# EasyEDA Pro project ProProject_Quadrotor_Mk2.epro, schematic Schematic1
Create Date: 2024-08-03; Page Name: P1; Project Name: Quadrotor_Mk2; Schematic Name: Schematic1; Update Date: 2024-09-01; Company: EasyEDA.com; Drawn: EasyEDA; Page Size: A4; Part Number: JLCPCB-002; Reviewed: EasyEDA; Version: V0.1
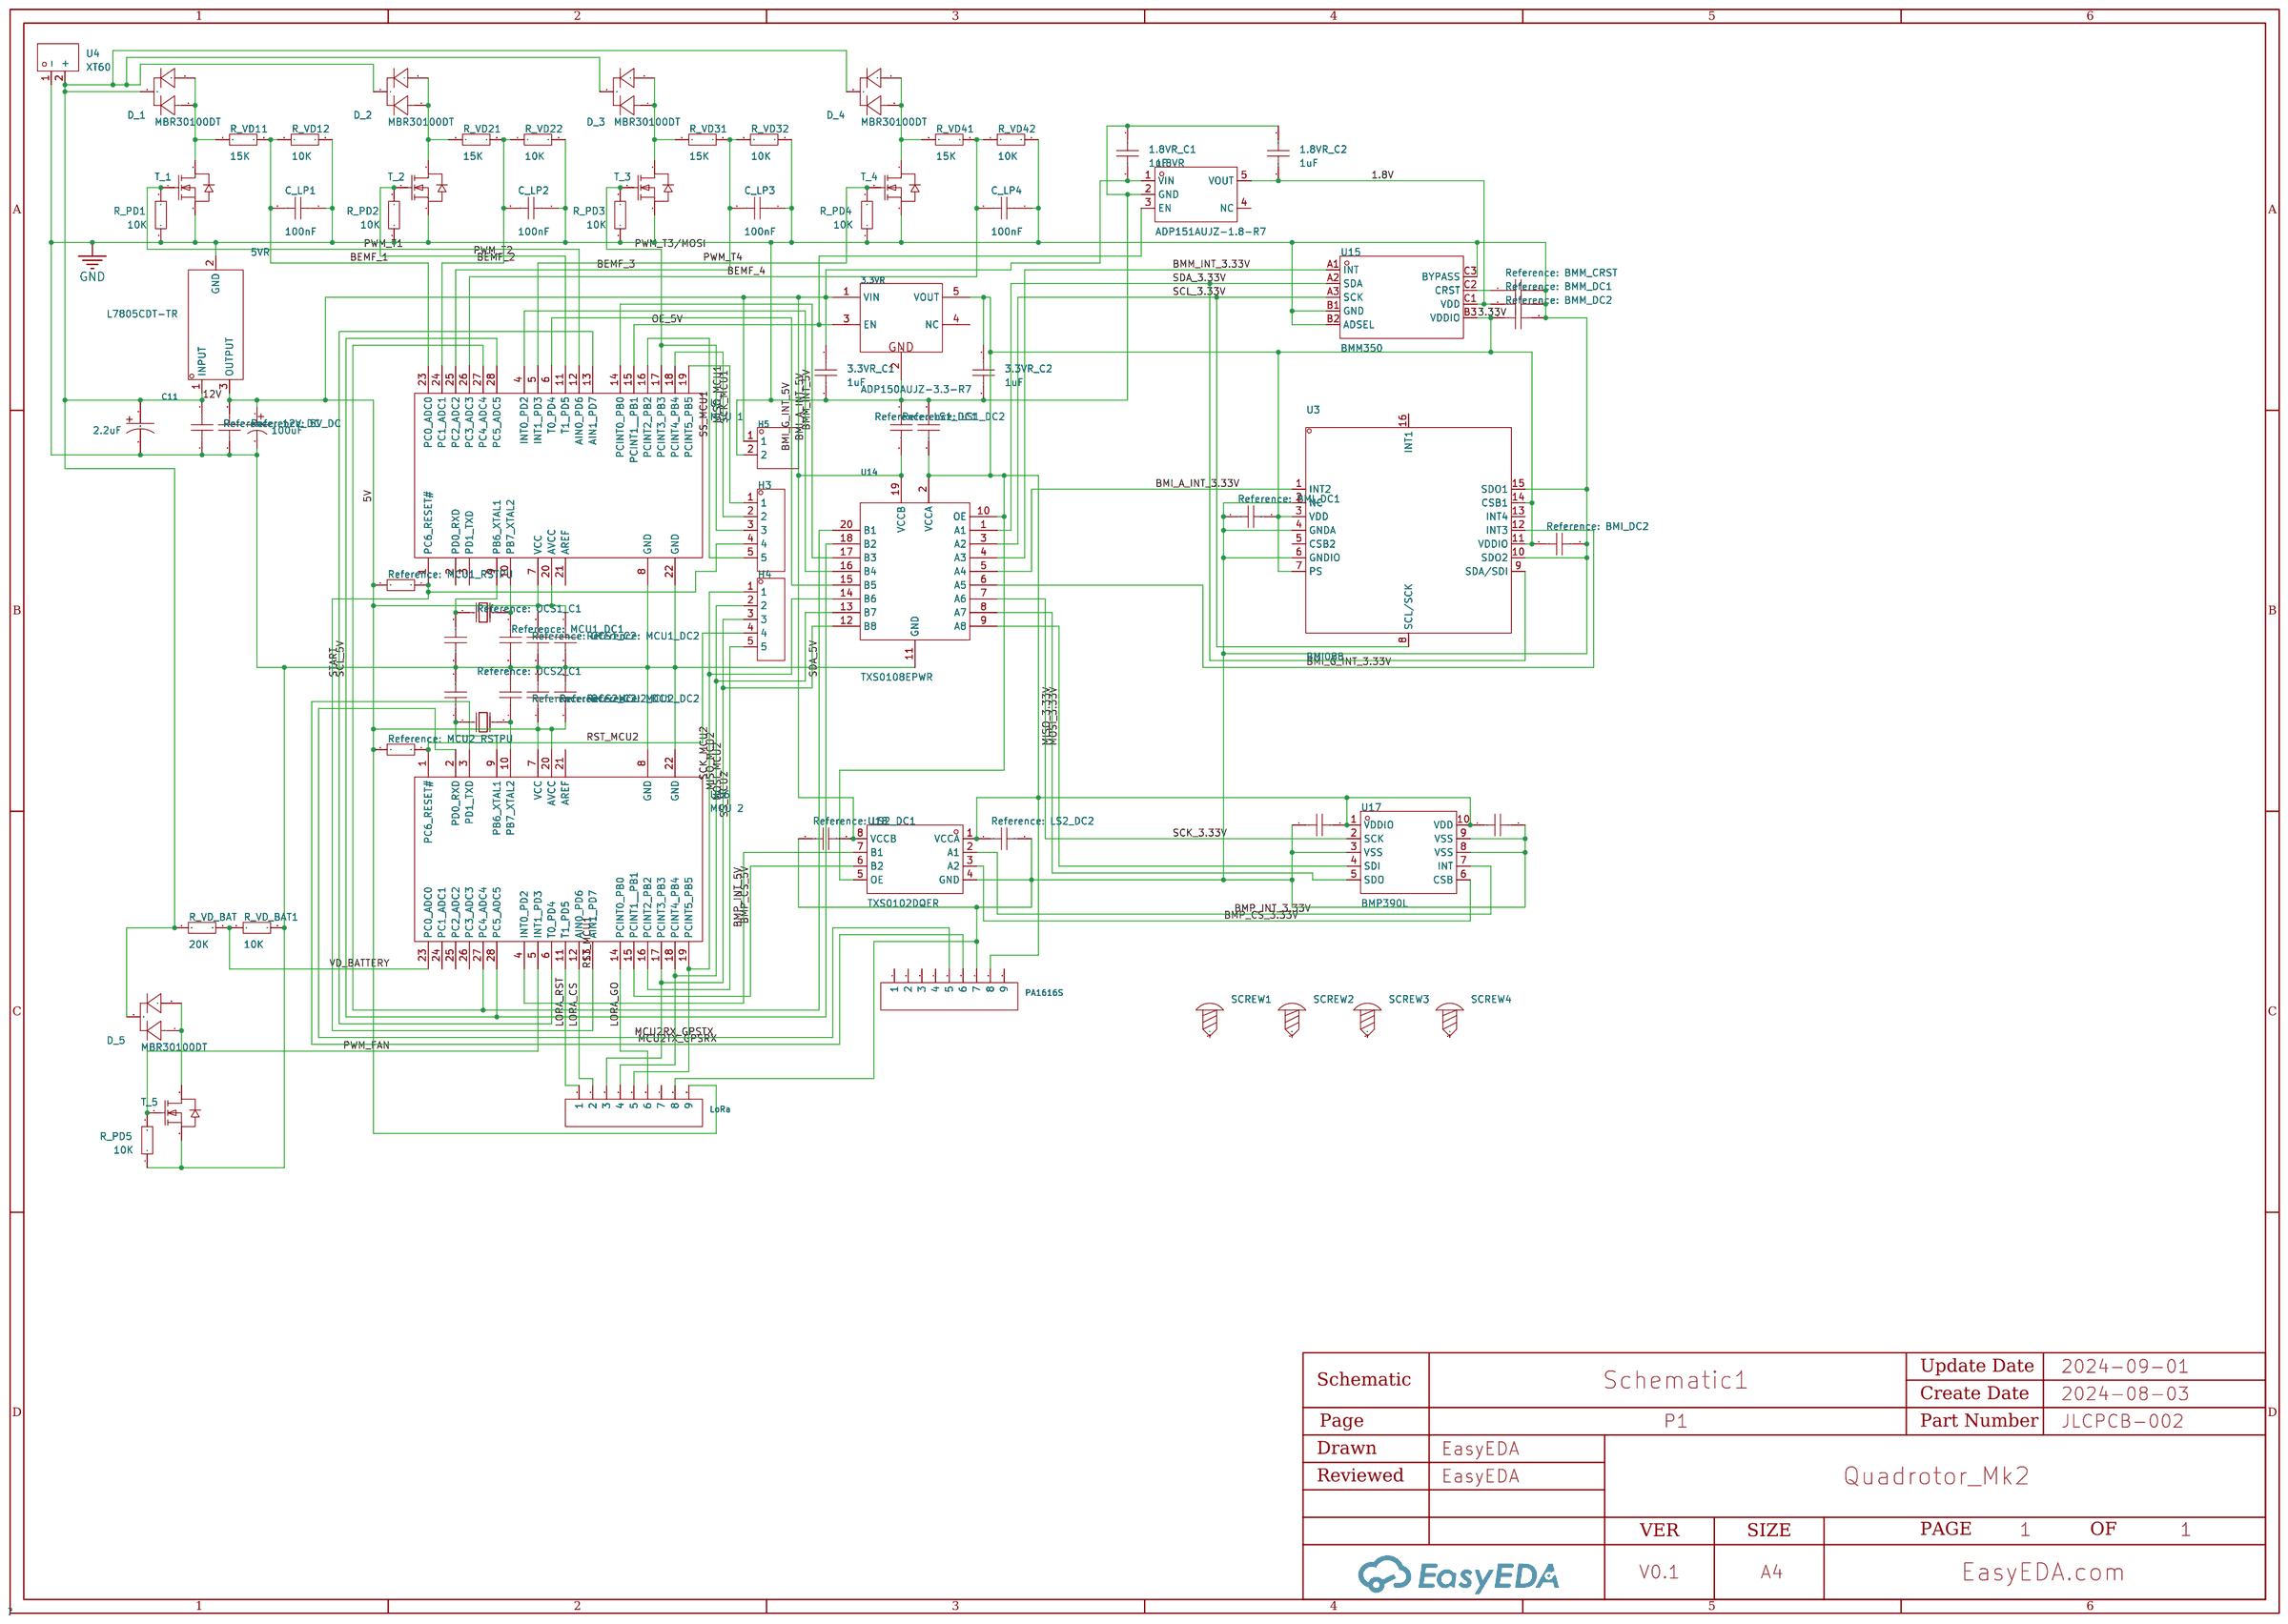
[diagram p0: schematic sheet]

## Parts
1.8VR  ADP151AUJZ-1.8-R7  [TSOT-23-5_L2.9-W1.6-P0.95-LS2.8-BR]
1.8VR_C1  1uF  [C0603]
1.8VR_C2  1uF  [C0603]
3.3VR  ADP150AUJZ-3.3-R7  [SOT-23-5_L3.0-W1.7-P0.95-LS2.8-BR]
3.3VR_C1  1uF  [C0603]
3.3VR_C2  1uF  [C0603]
5V_DC  100nF  [C0603]
5VR  L7805CDT-TR  [TO-252-3_L6.5-W5.8-P4.58-BL]
12V_DC  100nF  [C0603]
BMI_DC1  100nF  [C0603]
BMI_DC2  100nF  [C0603]
BMM_CRST  2.2uF  [C0603]
BMM_DC1  100nF  [C0603]
BMM_DC2  100nF  [C0603]
BMP_DC1  100nF  [C0603]
BMP_DC2  100nF  [C0603]
C11  2.2uF  [CAP-TH_BD5.0-P2.00-D0.8-FD]
C14  100uF  [CAP-TH_BD8.0-P3.50-D0.6-FD]
C_LP1  100nF  [C0603]
C_LP2  100nF  [C0603]
C_LP3  100nF  [C0603]
C_LP4  100nF  [C0603]
D_1  MBR30100DT  [TO-252-2_L6.6-W6.1-P4.58-LS9.9-BR]
D_2  MBR30100DT  [TO-252-2_L6.6-W6.1-P4.58-LS9.9-BR]
D_3  MBR30100DT  [TO-252-2_L6.6-W6.1-P4.58-LS9.9-BR]
D_4  MBR30100DT  [TO-252-2_L6.6-W6.1-P4.58-LS9.9-BR]
D_5  MBR30100DT  [TO-252-2_L6.6-W6.1-P4.58-LS9.9-BR]
H3  -  [HDR-TH_5P-P2.54-V-M]
H4  -  [HDR-TH_5P-P2.54-V-M]
H5  -  [HDR-TH_2P-P2.54-V-M-1]
LoRa  -  [HDR-TH_9P-P2.54-V-F-1]
LS1_DC1  100nF  [C0603]
LS1_DC2  100nF  [C0603]
LS2_DC1  100nF  [C0603]
LS2_DC2  100nF  [C0603]
MCU1_DC1  100nF  [C0603]
MCU1_DC2  100nF  [C0603]
MCU1_RSTPU  10K  [R0603]
MCU2_DC1  100nF  [C0603]
MCU2_DC2  100nF  [C0603]
MCU2_RSTPU  10K  [R0603]
OCS1_C1  22pF  [C0603]
OCS1_C2  22pF  [C0603]
OCS2_C1  22pF  [C0603]
OCS2_C2  22pF  [C0603]
PA1616S  -  [HDR-TH_9P-P2.54-V-F-1]
R_PD1  10K  [R0603]
R_PD2  10K  [R0603]
R_PD3  10K  [R0603]
R_PD4  10K  [R0603]
R_PD5  10K  [R0603]
R_VD11  15K  [R0603]
R_VD12  10K  [R0603]
R_VD21  15K  [R0603]
R_VD22  10K  [R0603]
R_VD31  15K  [R0603]
R_VD32  10K  [R0603]
R_VD41  15K  [R0603]
R_VD42  10K  [R0603]
R_VD_BAT  20K  [R0603]
R_VD_BAT1  10K  [R0603]
SCREW1  -  [Screw-Hole-M2]
SCREW2  -  [Screw-Hole-M2]
SCREW3  -  [Screw-Hole-M2]
SCREW4  -  [Screw-Hole-M2]
T_1  IRLR2908TRPBF  [TO-252-3_L6.5-W6.1-P4.58-LS9.9-BR]
T_2  IRLR2908TRPBF  [TO-252-3_L6.5-W6.1-P4.58-LS9.9-BR]
T_3  IRLR2908TRPBF  [TO-252-3_L6.5-W6.1-P4.58-LS9.9-BR]
T_4  IRLR2908TRPBF  [TO-252-3_L6.5-W6.1-P4.58-LS9.9-BR]
T_5  IRLR2908TRPBF  [TO-252-3_L6.5-W6.1-P4.58-LS9.9-BR]
U1  MCU 1  [DIP-28_L34.6-W7.3-P2.54-LS10.2-BL]
U3  BMI088  [LGA-16_L4.5-W3.0-P0.50-BL]
U4  XT60  [CONN-TH_XT60]
U14  TXS0108EPWR  [TSSOP-20_L6.5-W4.4-P0.65-LS6.4-BL]
U15  BMM350  [WLCSP-9_L1.3-W1.3-R3-C3-P0.40-TL]
U16  MCU 2  [DIP-28_L34.6-W7.3-P2.54-LS10.2-BL]
U17  BMP390L  [LGA-10_L2.0-W2.0-P0.50-TL_BMP390L]
U18  TXS0102DQER  [X2SON-8_L1.4-W1.0-P0.35-BL]
X2  20MHz  [OSC-TH_L10.0-W4.5-P5.00]
X3  20MHz  [OSC-TH_L10.0-W4.5-P5.00]

## Library data of the parts
1.8VR = ADP151AUJZ-1.8-R7_C462184: Output Type:-; Supplier Part: C462184; Manufacturer: ADI(亚德诺); Supplier Footprint: TSOT-23-5; JLCPCB Part Class: Extended Part; Datasheet: https://atta.szlcsc.com/upload/public/pdf/source/20200909/C658767_D89C1C1ABA9CE46752E76C45E865DF70.pdf; Supplier: LCSC
1.8VR_C1 1.8VR_C2 3.3VR_C1 3.3VR_C2 5V_DC 12V_DC BMI_DC1 BMI_DC2 BMM_CRST BMM_DC1 BMM_DC2 BMP_DC1 BMP_DC2 C_LP1-C_LP4 LS1_DC1 LS1_DC2 LS2_DC1 LS2_DC2 MCU1_DC1 MCU1_DC2 MCU2_DC1 MCU2_DC2 OCS1_C1 OCS1_C2 OCS2_C1 OCS2_C2 = CAP_0603: Supplier Footprint: 0603
3.3VR = ADP150AUJZ-3.3-R7: Output Type: Maximum Input Voltage:5.5V Output Voltage:3.3V Output Voltage:3.3V MAX Output Current:150mA Power Supply Rejection Ratio (PSRR):70dB Dropout Voltage:160mV@(150mA) standby current:22uA Operating Temperature:-40℃~+125℃ Operating Temperature:-40; LCSC Part Name: 输入5.5V 输出3.3V 150mA; Supplier Part: C29149; Manufacturer: ADI(亚德诺); Supplier Footprint: TSOT-23-5; JLCPCB Part Class: Extended Part; Datasheet: https://atta.szlcsc.com/upload/public/pdf/source/20140329/1457707036010.pdf; Supplier: LCSC; Maximum Input Voltage: 5.5V; Output Voltage: 3.3V; MAX Output Current: 150mA; Power Supply Rejection Ratio (PSRR): 70dB; Dropout Voltage: 160mV@(150mA); standby current: 22uA; Operating Temperature: -40℃~+125℃; Output Polarity: Positive electrode; Number of Outputs: 1
5VR = L7805CDT-TR: Output Type: Maximum Input Voltage:35V Output Voltage:5V Output Voltage:5V MAX Output Current:1.5A Power Supply Rejection Ratio (PSRR):62dB@(120Hz) Dropout Voltage:2V@(1A) standby current:8mA Operating Temperature:0℃~+125℃ Operating Temperature:0℃~+125℃ O; LCSC Part Name: 输入35V 输出5V 1.5A; Supplier Part: C310413; Manufacturer: ST(意法半导体); Supplier Footprint: DPAK; JLCPCB Part Class: Extended Part; Datasheet: https://atta.szlcsc.com/upload/public/pdf/source/20191219/C472632_C0855675BBC73B8C8E44EE1325AAD56A.pdf; Supplier: LCSC; Maximum Input Voltage: 35V; Output Voltage: 5V; MAX Output Current: 1.5A; Power Supply Rejection Ratio (PSRR): 62dB@(120Hz); Dropout Voltage: 2V@(1A); standby current: 8mA; Operating Temperature: 0℃~+125℃; Output Polarity: Positive electrode; Number of Outputs: 1
C11 = RC050M2R2LO5*11TH-2A1E: Capacitance: Tolerance:±20% Tolerance:±20% Rated Voltage: Ripple Current:90mA@100kHz Lead Spacing: φD: L: Lifetime @ Temp:2000hrs@105℃ Operating Temperature:-40℃~+105℃ Operating Temperature:-40℃~+105℃; LCSC Part Name: 2.2uF ±20% 50V; Supplier Part: C365766; Manufacturer: BERYL(绿宝石); Supplier Footprint: 插件,D5xL11mm; JLCPCB Part Class: Extended Part; Datasheet: https://atta.szlcsc.com/upload/public/pdf/source/20190116/C365813_D032970E50E497412ED095DEE828BCD0.pdf; Supplier: LCSC; Tolerance: ±20%; Ripple Current: 90mA@100kHz; Lifetime @ Temp: 2000hrs@105℃; Operating Temperature: -40℃~+105℃
C14 = 50YXF100MEFC8X11.5: Capacitance: Tolerance:±20% Tolerance:±20% Rated Voltage: Lead Spacing: φD: L: Lifetime @ Temp:7000hrs@105℃ Operating Temperature:-40℃~+105℃ Operating Temperature:-40℃~+105℃; LCSC Part Name: 100uF ±20% 50V; Supplier Part: C88728; Manufacturer: rubycon(红宝石); Supplier Footprint: 插件,D8xL11.5mm; JLCPCB Part Class: Extended Part; Datasheet: https://atta.szlcsc.com/upload/public/pdf/source/20170620/1497944728803.pdf; Supplier: LCSC; Tolerance: ±20%; Lifetime @ Temp: 7000hrs@105℃; Operating Temperature: -40℃~+105℃
D_1-D_5 = MBR30100DT_C18198672: Diode Configuration:Dual Common Cathode Forward Voltage (Vf@If):850mV@15A Reverse Voltage (Vr):100V Rectified Current:30A; LCSC Part Name: 电压:100V 电流:30A; Supplier Part: C18198672; Manufacturer: JUXING(钜兴); Supplier Footprint: TO-252; JLCPCB Part Class: Extended Part; Datasheet: https://atta.szlcsc.com/upload/public/pdf/source/20230921/3AE6E3A871F55A7FBECDA9283E6AB295.pdf; Supplier: LCSC; Diode Configuration: Dual Common Cathode; Forward Voltage (Vf@If): 850mV@15A; Reverse Voltage (Vr): 100V; Rectified Current: 30A
H3 H4 = HDR-M_2.54_1x5P: Supplier Footprint: Through
H5 = HDR-M_2.54_1x2P: Supplier Footprint: Through
LoRa PA1616S = HDR-F_2.54_1x9P: Supplier Footprint: Through
MCU1_RSTPU MCU2_RSTPU R_PD1-R_PD5 R_VD11 R_VD12 R_VD21 R_VD22 R_VD31 R_VD32 R_VD41 R_VD42 R_VD_BAT R_VD_BAT1 = Res_0603: Supplier Footprint: 0603
SCREW1-SCREW4 = Screw-Hole-M2: Supplier Footprint: 插件
T_1-T_5 = IRLR2908TRPBF: Type:1个NChannel Drain Source Voltage (Vdss): Continuous Drain Current (Id): Power Dissipation (Pd): Drain Source On Resistance (RDS(on)@Vgs,Id): Gate Threshold Voltage (Vgs(th)@Id):2.5V@250uA Total Gate Charge (Qg@Vgs):33nC@4.5V Input Capacitance (Ciss@Vd; LCSC Part Name: 1个N沟道 耐压:80V 电流:30A; Supplier Part: C520624; Manufacturer: Infineon(英飞凌); Supplier Footprint: DPAK; JLCPCB Part Class: Extended Part; Datasheet: https://atta.szlcsc.com/upload/public/pdf/source/20220726/2CD6B65121EF010F2BADC1C25F724DDE.pdf; Supplier: LCSC; Type: 1个NChannel; Gate Threshold Voltage (Vgs(th)@Id): 2.5V@250uA; Total Gate Charge (Qg@Vgs): 33nC@4.5V; Input Capacitance (Ciss@Vds): 1.89nF@25V; Operating Temperature: -55℃~+175℃@(Tj)
U1 U16 = ATMEGA328P-PU: CPU Core:AVR Program Storage Size:32KB RAM Size:2KB GPIO Ports Number:23 Operating Voltage Range:1.8V~5.5V Operating Voltage Range:1.8V~5.5V CPU Maximum Speed:20MHz Program Memory Type:FLASH EEPROM:1KB Operating Temperature Range:-40℃~+85℃ Operating Tempe; LCSC Part Name: 基于AVR增强型RISC架构的低功耗CMOS 8位微控制器 MSL=1; Supplier Part: C33901; Manufacturer: MICROCHIP(美国微芯); Supplier Footprint: DIP-28-300mil; JLCPCB Part Class: Extended Part; Datasheet: https://atta.szlcsc.com/upload/public/pdf/source/20150124/1457707257819.pdf; Supplier: LCSC; CPU Core: AVR; Program Storage Size: 32KB; RAM Size: 2KB; GPIO Ports Number: 23; Operating Voltage Range: 1.8V~5.5V; CPU Maximum Speed: 20MHz; Program Memory Type: FLASH; EEPROM: 1KB; Operating Temperature Range: -40℃~+85℃; ADC (Bit): 10bit; Peripheral/Function: WDT；PWM; Watchdog: 有; Low-Voltage Detect: 有; Internal Oscillator: 有
U3 = BMI088: Sensor Type:加速度计陀螺仪 Operating Temperature:-40℃~+85℃ Operating Temperature:-40℃~+85℃; Supplier Part: C194919; Manufacturer: Bosch(博世); Supplier Footprint: LGA-16(3x4.5); JLCPCB Part Class: Extended Part; Datasheet: https://atta.szlcsc.com/upload/public/pdf/source/20180628/C194919_66CCF125FF968C218A4D358C68AC68D6.pdf; Supplier: LCSC; Sensor Type: 加速度计陀螺仪; Operating Temperature: -40℃~+85℃
U4 = XT60: Brand:艾迈斯 Model:XT60 Power:- Output:- Input:- Size:- Interface:- Type:- Colour:Yellow MaximumCurrent:- Type:香蕉头 RatedVoltage:- Type1:- NumberOfUSBHoles:- InterfaceType:公头 MetalMaterial:- InsulationMaterial:- RatedCurrent:- RecommendedWireGauge:- FlameReta; LCSC Part Name: AMASS(艾迈斯) XT60模型插头 3.5mm镀金香蕉头公头（电调端）XT60-M; Supplier Part: C98733; Manufacturer: AMASS(艾迈斯); JLCPCB Part Class: Extended Part; Datasheet: https://atta.szlcsc.com/upload/public/pdf/source/20170606/1496716524919.pdf; Supplier: LCSC; Brand: 艾迈斯; Type: 香蕉头; Colour: Yellow; InterfaceType: 公头; specifications: 3.5mm
U14 = TXS0108EPWR: Channel Type:Bi-Directional Input Signal:- Output Signal:- Data Rate:60Mbps Supply Voltage (VCCA):1.4V~3.6V Supply Voltage (VCCA):1.4V~3.6V Supply Voltage (VCCB):1.65V~5.5V Supply Voltage (VCCB):1.65V~5.5V Number of Circuits:1 Channels per Circuit:8 Outpu; LCSC Part Name: 60Mbps 8位双向电平转换器; Supplier Part: C17206; Manufacturer: TI(德州仪器); Supplier Footprint: TSSOP-20; JLCPCB Part Class: Extended Part; Datasheet: http://www.ti.com/cn/lit/gpn/txs0108e; Supplier: LCSC; Channel Type: Bi-Directional; Data Rate: 60Mbps; Supply Voltage (VCCA): 1.4V~3.6V; Supply Voltage (VCCB): 1.65V~5.5V; Number of Circuits: 1; Channels per Circuit: 8; Output Type: Open Drain；Push-pull; Operating Temperature: -40℃~+85℃; Features: 自动方向检测
U15 = BMM350: Supplier Part: C7496950; Supplier Footprint: BGA-9_1.28X1.28mm; JLCPCB Part Class: Extended Part; Supplier: LCSC
U17 = BMP390L: Supplier Part: C2684802; Manufacturer: Bosch(博世); Supplier Footprint: LGA-10(2x2x0.5); JLCPCB Part Class: Extended Part; Datasheet: https://atta.szlcsc.com/upload/public/pdf/source/20221222/1C81EE3357D96DEF74970C4DA2251172.pdf; Supplier: LCSC
U18 = TXS0102DQER: Channel Type:Bi-Directional Input Signal:- Output Signal:- Data Rate:24Mbps Supply Voltage (VCCA):1.65V~3.6V Supply Voltage (VCCA):1.65V~3.6V Supply Voltage (VCCB):2.3V~5.5V Supply Voltage (VCCB):2.3V~5.5V Number of Circuits:1 Channels per Circuit:2 Outpu; LCSC Part Name: 24Mbps 2位双向电平转换器; Supplier Part: C2652935; Manufacturer: TI(德州仪器); Supplier Footprint: X2-SON-8(1x1.4); JLCPCB Part Class: Extended Part; Datasheet: https://www.ti.com/cn/lit/gpn/txs0102; Supplier: LCSC; Channel Type: Bi-Directional; Data Rate: 24Mbps; Supply Voltage (VCCA): 1.65V~3.6V; Supply Voltage (VCCB): 2.3V~5.5V; Number of Circuits: 1; Channels per Circuit: 2; Output Type: Open Drain；Push-pull; Operating Temperature: -40℃~+85℃; Features: 自动方向检测
X2 X3 = 49SAC16000182060: Crystal Type:直插晶振 Frequency: Normal temperature Frequency Tolerance:±20ppm Normal temperature Frequency Tolerance:±20ppm External load capacitor: Frequency Stability(Full temperature range):±30ppm Frequency Stability(Full temperature range):±30ppm Equival; LCSC Part Name: 16MHz ±20ppm 18pF; Supplier Part: C443538; Manufacturer: JGHC(晶光华); Supplier Footprint: HC-49S; JLCPCB Part Class: Extended Part; Datasheet: https://atta.szlcsc.com/upload/public/pdf/source/20191118/C443544_FEE5A62AFE1FD73D91893808184C550C.pdf; Supplier: LCSC; Crystal Type: 直插晶振; Normal temperature Frequency Tolerance: ±20ppm; Frequency Stability(Full temperature range): ±30ppm; Equivalent Series Resistance (ESR): 60Ω

## Nets
1.8V: 1.8VR.5(VOUT) 1.8VR_C2.2 BMM_DC1.1 U15.C1(VDD)
3.33V: 3.3VR.5(VOUT) 3.3VR_C2.1 BMI_DC1.2 BMI_DC2.1 BMM_DC2.1 BMP_DC1.2 BMP_DC2.1 LS1_DC2.2 LS2_DC2.1 PA1616S.8 U3.3(VDD) U3.7(PS) U3.11(VDDIO) U3.14(CSB1) U14.2(VCCA) U14.10(OE) U15.B3(VDDIO) U17.1(VDDIO) U17.10(VDD) U18.1(VCCA) U18.5(OE)
5V: 1.8VR.1(VIN) 1.8VR_C1.2 3.3VR.1(VIN) 3.3VR_C1.1 5V_DC.1 5VR.3(OUTPUT) C14.1 H5.1 LoRa.9 LS1_DC1.2 LS2_DC1.2 MCU1_DC1.1 MCU1_DC2.1 MCU1_RSTPU.2 MCU2_DC1.1 MCU2_DC2.1 MCU2_RSTPU.2 U1.7(VCC) U1.20(AVCC) U14.19(VCCB) U16.7(VCC) U16.20(AVCC) U18.8(VCCB)
12V: 5VR.1(INPUT) 12V_DC.1 C11.1 D_1.2(A) D_2.2(A) D_3.2(A) D_4.2(A) D_5.2(A) R_VD_BAT.1 U4.2(+)
GND: 1.8VR.2(GND) 1.8VR_C1.1 1.8VR_C2.1 3.3VR.2(GND) 3.3VR_C1.2 3.3VR_C2.2 5V_DC.2 5VR.2(GND) 12V_DC.2 BMI_DC1.1 BMI_DC2.2 BMM_CRST.2 BMM_DC1.2 BMM_DC2.2 BMP_DC1.1 BMP_DC2.2 C11.2 C14.2 C_LP1.1 C_LP2.1 C_LP3.1 C_LP4.1 H5.2 LoRa.8 LS1_DC1.1 LS1_DC2.1 LS2_DC1.1 LS2_DC2.2 MCU1_DC1.2 MCU1_DC2.2 MCU2_DC1.2 MCU2_DC2.2 OCS1_C1.2 OCS1_C2.2 OCS2_C1.2 OCS2_C2.2 PA1616S.7 R_PD1.1 R_PD2.1 R_PD3.1 R_PD4.1 R_PD5.1 R_VD12.2 R_VD22.2 R_VD32.2 R_VD42.2 R_VD_BAT1.2 T_1.3(S) T_2.3(S) T_3.3(S) T_4.3(S) T_5.3(S) U1.8(GND) U1.22(GND) U3.2(NC) U3.4(GNDA) U3.6(GNDIO) U3.10(SDO2) U3.15(SDO1) U4.1(-) U14.11(GND) U15.B1(GND) U15.B2(ADSEL) U15.C3(BYPASS) U16.8(GND) U16.22(GND) U17.3(VSS) U17.8(VSS) U17.9(VSS) U18.4(GND)
BEMF_1: C_LP1.2 R_VD11.2 R_VD12.1 U1.23(PC0 ADC0)
BEMF_2: C_LP2.2 R_VD21.2 R_VD22.1 U1.24(PC1 ADC1)
BEMF_3: C_LP3.2 R_VD31.2 R_VD32.1 U1.25(PC2 ADC2)
BEMF_4: C_LP4.2 R_VD41.2 R_VD42.1 U1.26(PC3 ADC3)
BMI_A_INT_3.33V: U3.1(INT2) U14.5(A4)
BMI_A_INT_5V: U1.4(INT0 PD2) U14.16(B4)
BMI_G_INT_3.33V: U3.12(INT3) U14.6(A5)
BMI_G_INT_5V: U1.6(T0 PD4) U14.15(B5)
BMM_INT_3.33V: U14.4(A3) U15.A1(INT)
BMM_INT_5V: U1.14(PCINT0 PB0) U14.17(B3)
BMP_CS_3.33V: U17.6(CSB) U18.3(A2)
BMP_CS_5V: U16.15(PCINT1  PB1) U18.6(B2)
BMP_INT_3.33V: U17.7(INT) U18.2(A1)
BMP_INT_5V: U16.4(INT0 PD2) U18.7(B1)
LORA_CS: LoRa.2 U16.12(AIN0 PD6)
LORA_GO: LoRa.6 U16.14(PCINT0 PB0)
LORA_RST: LoRa.1 U16.11(T1 PD5)
MCU2RX_GPSTX: PA1616S.5 U16.2(PD0 RXD)
MCU2TX_GPSRX: PA1616S.6 U16.3(PD1 TXD)
MISO_3.33V: U14.8(A7) U17.5(SDO)
MISO_MCU1: H3.2 U1.18(PCINT4 PB4)
MISO_MCU2: H4.2 LoRa.4 U14.13(B7) U16.18(PCINT4 PB4)
MOSI_3.33V: U14.9(A8) U17.4(SDI)
MOSI_MCU2: H4.3 LoRa.3 U14.12(B8) U16.17(PCINT3 PB3)
OE_5V: 1.8VR.3(EN) 3.3VR.3(EN) U1.15(PCINT1  PB1)
PWM_FAN: R_PD5.2 T_5.1(G) U16.5(INT1 PD3)
PWM_T1: R_PD1.2 T_1.1(G) U1.12(AIN0 PD6)
PWM_T2: R_PD2.2 T_2.1(G) U1.11(T1 PD5)
PWM_T3/MOSI: H3.3 R_PD3.2 T_3.1(G) U1.17(PCINT3 PB3)
PWM_T4: R_PD4.2 T_4.1(G) U1.5(INT1 PD3)
RST_MCU1: H3.4 MCU1_RSTPU.1 U1.1(PC6 RESET#) U16.13(AIN1 PD7)
RST_MCU2: H4.4 MCU2_RSTPU.1 U16.1(PC6 RESET#)
SCK_3.33V: U14.7(A6) U17.2(SCK)
SCK_MCU1: H3.1 U1.19(PCINT5 PB5)
SCK_MCU2: H4.1 LoRa.5 U14.14(B6) U16.19(PCINT5 PB5)
SCL_3.33V: U3.8(SCL/SCK) U14.3(A2) U15.A3(SCK)
SCL_5V: U1.28(PC5 ADC5) U14.18(B2) U16.28(PC5 ADC5)
SDA_3.33V: U3.9(SDA/SDI) U14.1(A1) U15.A2(SDA)
SDA_5V: U1.27(PC4 ADC4) U14.20(B1) U16.27(PC4 ADC4)
SS_MCU1: H3.5 U1.16(PCINT2 PB2)
SS_MCU2: H4.5 U16.16(PCINT2 PB2)
START: U1.13(AIN1 PD7) U16.6(T0 PD4)
VD_BATTERY: R_VD_BAT.2 R_VD_BAT1.1 U16.23(PC0 ADC0)
$1N565: D_1.1(K) D_1.3(K) R_VD11.1 T_1.2(D)
$1N1007: D_2.1(K) D_2.3(K) R_VD21.1 T_2.2(D)
$1N1195: D_3.1(K) D_3.3(K) R_VD31.1 T_3.2(D)
$1N1383: D_4.1(K) D_4.3(K) R_VD41.1 T_4.2(D)
$1N12852: BMM_CRST.1 U15.C2(CRST)
$1N22123: D_5.1(K) D_5.3(K) T_5.2(D)
$1N32305: OCS2_C1.1 U16.9(PB6 XTAL1) X2.1(OSC1)
$1N32306: OCS1_C1.1 U1.9(PB6 XTAL1) X3.1(OSC1)
$1N32315: OCS2_C2.1 U16.10(PB7 XTAL2) X2.2(OSC2)
$1N32316: OCS1_C2.1 U1.10(PB7 XTAL2) X3.2(OSC2)

Not connected (* = marked no-connect by the designer): 1.8VR 4(NC); 3.3VR 4(NC); LoRa 7; PA1616S 1 2 3 4 9; SCREW1 1; SCREW2 1; SCREW3 1; SCREW4 1; U1 2(PD0 RXD) 3(PD1 TXD) 21(AREF); U3 5(CSB2) 13(INT4) 16(INT1); U16 21(AREF) 24(PC1 ADC1) 25(PC2 ADC2) 26(PC3 ADC3)
